# Altium schematic sheet TDII_BT_R00.SchDoc
size A4
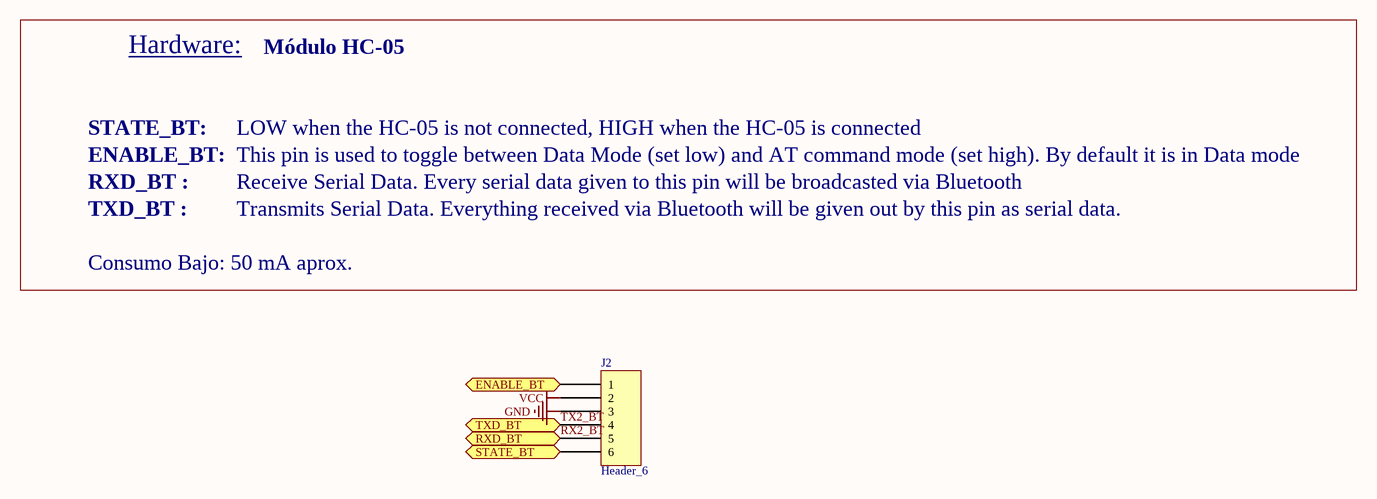
[diagram p0: TDII_BT_R00.SchDoc]

## Parts
J2  Header_6  [HEADER_1x6]

## Ports
ENABLE_BT (in), RXD_BT (out), STATE_BT (out), TXD_BT (in)

## Nets
GND: J2.3
VCC: J2.2
ENABLE_BT: J2.1 ; port ENABLE_BT
RX2_BT: J2.5 ; port RXD_BT
STATE_BT: J2.6 ; port STATE_BT
TX2_BT: J2.4 ; port TXD_BT

## Notes on the sheet
- Hardware:
- Módulo HC-05
- ENABLE_BT:
- STATE_BT:
- RXD_BT :
- LOW when the HC-05 is not connected, HIGH when the HC-05 is connected
- This pin is used to toggle between Data Mode (set low) and AT command mode (set high). By default it is in Data mode
- Receive Serial Data. Every serial data given to this pin will be broadcasted via Bluetooth
- TXD_BT :
- Transmits Serial Data. Everything received via Bluetooth will be given out by this pin as serial data.
- Consumo Bajo: 50 mA aprox.

## Library data of the parts
J2 = Conector_6 ( 0.100¨)